# Altium schematic sheet WiringSchematic.SchDoc
size 420 x 297 mm; SheetNumber: 3; SheetTotal: 3
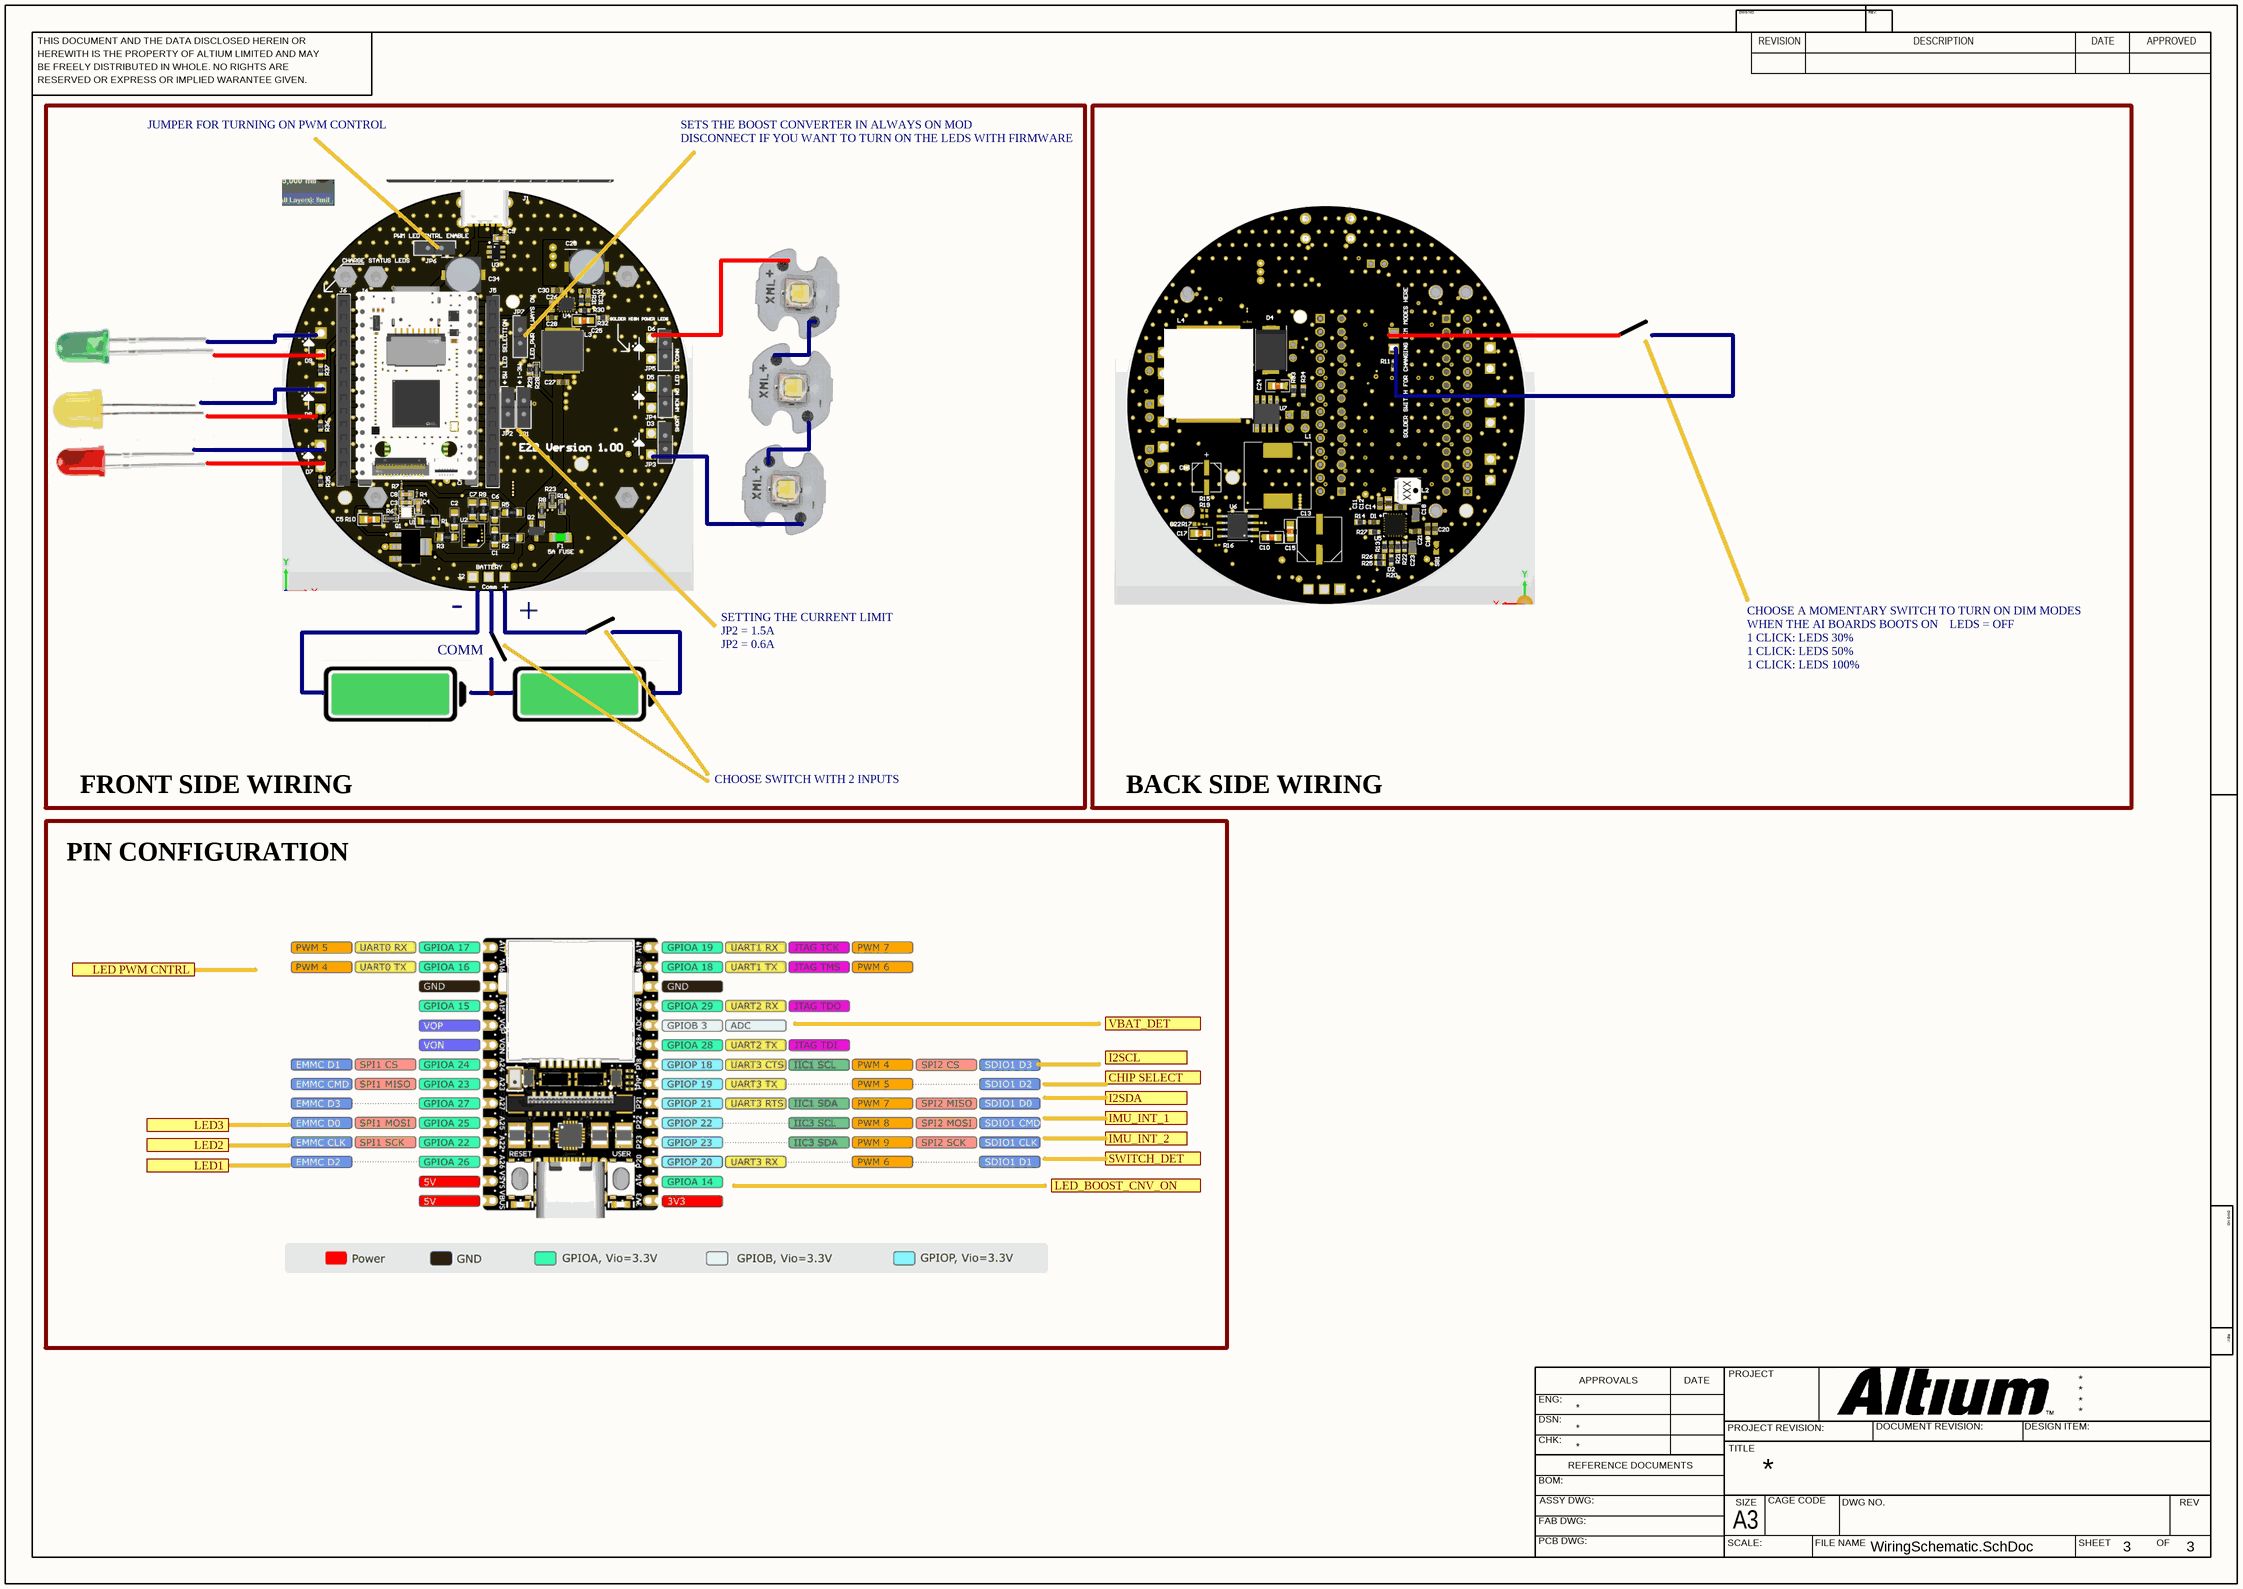
[diagram p0: WiringSchematic.SchDoc]

## Ports
CHIP SELECT, I2SCL, I2SDA, IMU_INT_1, IMU_INT_2, LED1, LED2, LED3, LED PWM CNTRL, LED_BOOST_CNV_ON, SWITCH_DET, VBAT_DET

## Notes on the sheet
- JUMPER FOR TURNING ON PWM CONTROL
- SETS THE BOOST CONVERTER IN ALWAYS ON MOD
- DISCONNECT IF YOU WANT TO TURN ON THE LEDS WITH FIRMWARE
- COMM
- -
- +
- SETTING THE CURRENT LIMIT
- JP2 = 1.5A
- JP2 = 0.6A
- CHOOSE A MOMENTARY SWITCH TO TURN ON DIM MODES
- 1 CLICK: LEDS 30%
- WHEN THE AI BOARDS BOOTS ON
- 1 CLICK: LEDS 50%
- 1 CLICK: LEDS 100%
- LEDS = OFF
- FRONT SIDE WIRING
- CHOOSE SWITCH WITH 2 INPUTS
- BACK SIDE WIRING
- PIN CONFIGURATION
- THIS DOCUMENT AND THE DATA DISCLOSED HEREIN OR
- HEREWITH IS THE PROPERTY OF ALTIUM LIMITED AND MAY
- DWG NO:
- REVISION
- REV:
- DESCRIPTION
- DATE
- APPROVED
- BE FREELY DISTRIBUTED IN WHOLE. NO RIGHTS ARE
- RESERVED OR EXPRESS OR IMPLIED WARANTEE GIVEN.
- ENG:
- APPROVALS
- PROJECT
- DSN:
- CHK:
- REFERENCE DOCUMENTS
- PROJECT REVISION:
- TITLE
- DOCUMENT REVISION:
- DESIGN ITEM:
- BOM:
- FAB DWG:
- PCB DWG:
- ASSY DWG:
- SCALE:
- A3
- SIZE
- CAGE CODE
- FILE NAME
- DWG NO.
- SHEET
- OF
- REV